# EAGLE design Qwiic_Grideye (EAGLE 7.7.0)
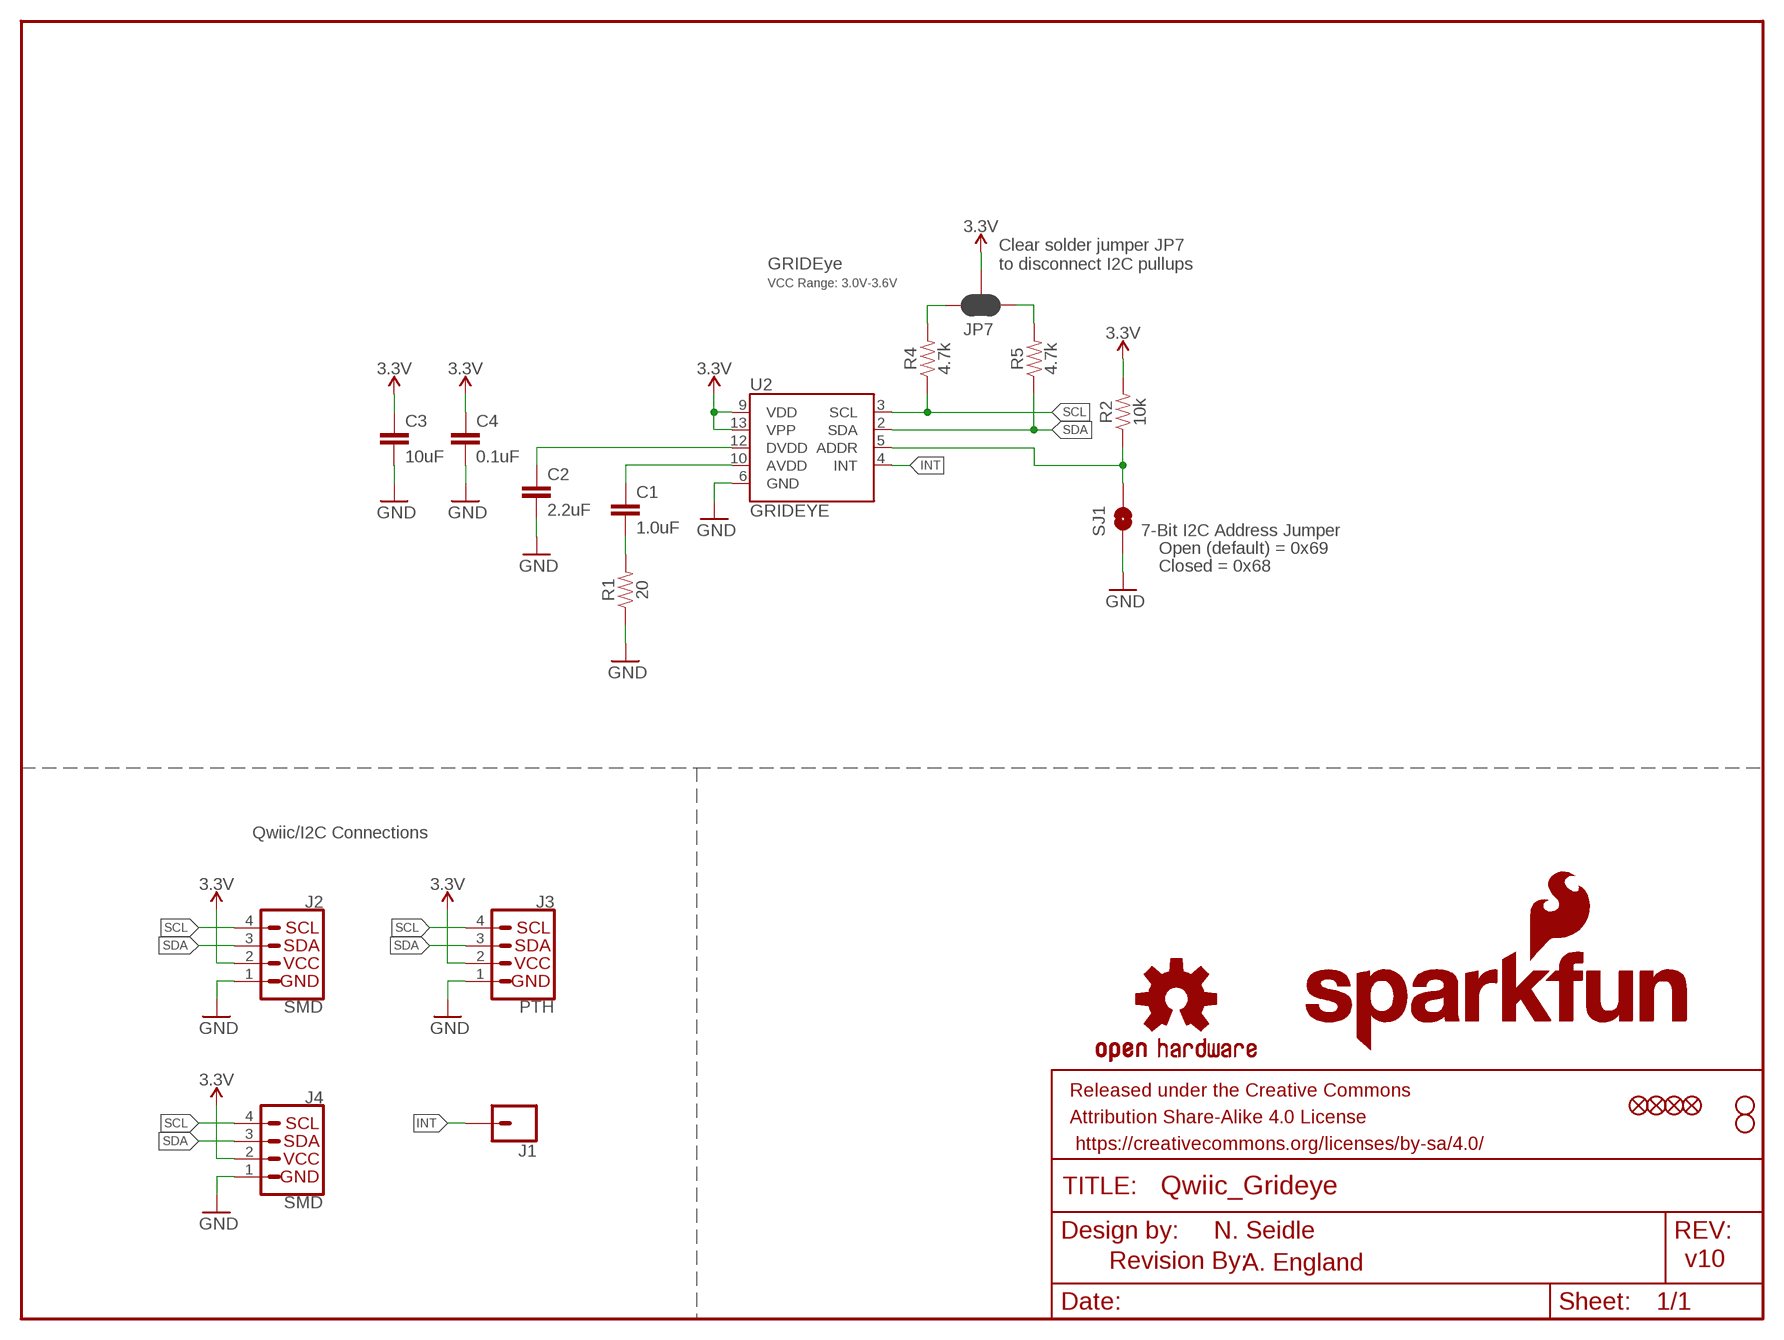
[diagram p0: schematic, sheet 1]

## Parts
C1  1.0uF  1.0UF-0603-16V-10%  [0603]
C2  2.2uF  2.2UF-0603-10V-20%  [0603]
C3  10uF  10UF-0603-6.3V-20%  [0603]
C4  0.1uF  0.1UF-0603-25V-(+80/-20%)  [0603]
FRAME1  FRAME-LETTER  [CREATIVE_COMMONS]
J1  CONN_01PTH_NO_SILK_YES_STOP  [1X01_NO_SILK]
J2  SMD  I2C_STANDARDJS-1MM  [1X04_1MM_RA]
J3  PTH  I2C_STANDARD_NO_SILK  [1X04_NO_SILK]
J4  SMD  I2C_STANDARDJS-1MM  [1X04_1MM_RA]
JP1  FIDUCIALUFIDUCIAL  [MICRO-FIDUCIAL]
JP2  FIDUCIALUFIDUCIAL  [MICRO-FIDUCIAL]
JP3  STAND-OFF  [STAND-OFF]
JP4  STAND-OFF  [STAND-OFF]
JP5  FIDUCIALUFIDUCIAL  [MICRO-FIDUCIAL]
JP6  FIDUCIALUFIDUCIAL  [MICRO-FIDUCIAL]
JP7  JUMPER-SMT_3_2-NC_PASTE_SILK  [SMT-JUMPER_3_2-NC_PASTE_SILK]
LOGO1  OSHW-LOGOMINI  [OSHW-LOGO-MINI]
LOGO2  REVISION  [REVISION]
R1  20  20OHM-0603-1/10W-1%  [0603]
R2  10k  10KOHM-0603-1/10W-1%  [0603]
R4  4.7k  4.7KOHM-0603-1/10W-1%  [0603]
R5  4.7k  4.7KOHM-0603-1/10W-1%  [0603]
SJ1  SOLDERJUMPERNO  [SJ_2S-NO]
U2  GRIDEYE  [GRIDEYE-AMG88]
U$1  SFE_LOGO_NAME.1_INCH  [SFE_LOGO_NAME_.1]
U$2  SFE_LOGO_NAME_FLAME.1_INCH  [SFE_LOGO_NAME_FLAME_.1]

## Nets
3.3V: C3.1 C4.1 J2.2(VCC) J3.2(VCC) J4.2(VCC) JP7.2 R2.2 U2.9(VDD) U2.13(VPP)
ADDR: R2.1 SJ1.2 U2.5(ADDR)
GND: C2.2 C3.2 C4.2 J2.1(GND) J3.1(GND) J4.1(GND) R1.1 SJ1.1 U2.6(GND)
INT: J1.1 U2.4(INT)
N$1: JP7.1 R5.2
N$2: JP7.3 R4.2
N$3: C2.1 U2.12(DVDD)
N$4: C1.1 U2.10(AVDD)
N$5: C1.2 R1.2
SCL: J2.4(SCL) J3.4(SCL) J4.4(SCL) R4.1 U2.3(SCL)
SDA: J2.3(SDA) J3.3(SDA) J4.3(SDA) R5.1 U2.2(SDA)

## Notes on the sheet
- GRIDEye
- Clear solder jumper JP7 
  to disconnect I2C pullups
- VCC Range: 3.0V-3.6V
- 7-Bit I2C Address Jumper
- Open (default) = 0x69
- Closed = 0x68
- Qwiic/I2C Connections
- N. Seidle
- A. England | v10

## Library data of the parts
C1 = SparkFun-Capacitors:1.0UF: 1µF ceramic capacitors A capacitor is a passive two-terminal electrical component used to store electrical energy temporarily in an electric field.; PROD_ID: CAP-00868
C2 = SparkFun-Capacitors:2.2UF: 2.2µF ceramic capacitors A capacitor is a passive two-terminal electrical component used to store electrical energy temporarily in an electric field.; PROD_ID: CAP-07888
C3 = SparkFun-Capacitors:10UF: 10.0µF ceramic capacitors A capacitor is a passive two-terminal electrical component used to store electrical energy temporarily in an electric field.; PROD_ID: CAP-11015
C4 = SparkFun-Capacitors:0.1UF: 0.1µF ceramic capacitors A capacitor is a passive two-terminal electrical component used to store electrical energy temporarily in an electric field.; PROD_ID: CAP-00810
FRAME1 = SparkFun-Aesthetics:FRAME-LETTER: Schematic Frame - Letter Standard 8.5x11 US Letter frame
J1 = SparkFun-Connectors:CONN_01: Single connection point. Often used as Generic Header-pin footprint for 0.1 inch spaced/style header connections On any of the 0.1 inch spaced packages, you can populate with these: Break Away Headers - Straight <https://www.sparkfun.com/products/116> (PRT-00116) Break Away Male Headers - Right Angle <https://www.sparkfun.com/products/553> (PRT-00553) Female Headers <https://www.sparkfun.com/products/115> (PRT-00115) Break Away Headers - Machine Pin <https://www.sparkfun.com/products/117> (PRT-00117) Break Away Female Headers - Swiss Machine Pin <https://www.sparkfun.com/products/743> (PRT-00743) This device is also useful as a general connection point to wire up your design to another part of your project. Our various solder wires solder well into these plated through hole pads. Hook-Up Wire - Assortment (Stranded, 22 AWG) <https://www.sparkfun.com/products/11375> (PRT-11375) Hook-Up Wire - Assortment (Solid Core, 22 AWG) <https://www.sparkfun.com/products/11367> (PRT-11367) View the entire wire category on our website here <https://www.sparkfun.com/categories/141> Special notes: SMTSO-256-ET is a "flush mount" nut for a 4-40 screw. We mostly use this on specialty testbeds; it is a nice way to connect hardware to your PCB at an adjustable hieght. Also note, the SNAP packages are for using a snappable style connector. We sell a baggie of snaps and they are also used on two LilyPad designs: Snap Assortment - 30 pack (male and female) <https://www.sparkfun.com/products/11347> (DEV-11347) LilyPad Arduino SimpleSnap <https://www.sparkfun.com/products/10941> (DEV-10941) LilyPad SimpleSnap Protoboard <https://www.sparkfun.com/products/10940> (DEV-10940)
J2-J4 = SparkX:I2C_STANDARD: SparkFun I2C Standard Pinout Header SparkFun has standardized on a pinout for all I2C based sensor breakouts. This pinout allows I2C boards to be plugged directly into the headers on Arduino Uno compatible boards, and to be daisy chained easily. Example SparkFun Products: SparkFun Atmospheric Sensor Breakout - BME280 <https://www.sparkfun.com/products/13676> SparkFun Altitude/Pressure Sensor Breakout - MPL3115A2 <https://www.sparkfun.com/products/11084> SparkFun TOF Range Finder Sensor - VL6180 <https://www.sparkfun.com/products/12785>
JP1 JP2 JP5 JP6 = SparkFun:FIDUCIAL: Fiducial Alignment Points Various fiducial points for machine vision alignment.
JP3 JP4 = SparkFun:STAND-OFF: Stand Off This is the mechanical footprint for a #4 phillips button head screw. Use the keepout ring to avoid running the screw head into surrounding components. SKU : PRT-00447
JP7 = SparkFun-Jumpers:JUMPER-SMT_3_2-NC_PASTE: Normally closed solder jumper (2 of 2 connections) This jumper has an aperture in the stencil to allow solder paste to bridge both connections. Both connections are normally closed (NC). Wick off the solder to open the connection(s). Reapply solder to reclose the connection(s).
LOGO1 = SparkFun-Aesthetics:OSHW-LOGO: Open-Source Hardware (OSHW) Logo This logo indicates the piece of hardware it is found on incorporates a OSHW license and/or adheres to the definition of open source hardware found here: http://freedomdefined.org/OSHW
LOGO2 = SparkFun-Aesthetics:REVISION: "Revision By" Text Preceding text for revisor documentation. Includes schematic text on "symbols" layer, and board text on tDoc.
R1 = SparkFun-Resistors:20OHM: RES-07862; PROD_ID: RES-07862
R2 = SparkFun-Resistors:10KOHM: 10kΩ resistor A resistor is a passive two-terminal electrical component that implements electrical resistance as a circuit element. Resistors act to reduce current flow, and, at the same time, act to lower voltage levels within circuits. - Wikipedia; PROD_ID: RES-00824
R4 R5 = SparkFun-Resistors:4.7KOHM: 4.7kΩ resistor A resistor is a passive two-terminal electrical component that implements electrical resistance as a circuit element. Resistors act to reduce current flow, and, at the same time, act to lower voltage levels within circuits. - Wikipedia; PROD_ID: RES-07857
SJ1 = SparkFun:SOLDERJUMPER: Solder Jumper Standard SMD solder jumper. Used to automate production. Two varients : Normally Open and Normally Closed are the same, but have different paste layers. NC will have a large amount of paste and should jumper during reflow.
U2 = SparkFun-Sensors:GRIDEYE: Panasonic AMG8833 GRIDEye This 8x8 thermopile infrared sensor array allows for a low resolution thermal camera.; PROD_ID: IC-13912
U$1 = SparkFun-Aesthetics:SFE_LOGO_NAME: SparkFun Font Logo This is the SparkFun name logo. The logo on the schematic will always be the same size; the package variant is the height of the flame part of the logo (or the height the flame would be, if it were drawn). Default layer for the logo on the board is tSilk.
U$2 = SparkFun-Aesthetics:SFE_LOGO_NAME_FLAME: SparkFun Font Logo w/ Flame This is the SparkFun full logo. The logo on the schematic will always be the same size; the package variant is the height of the flame part of the logo. Default layer for the logo on the board is tSilk.

## Board
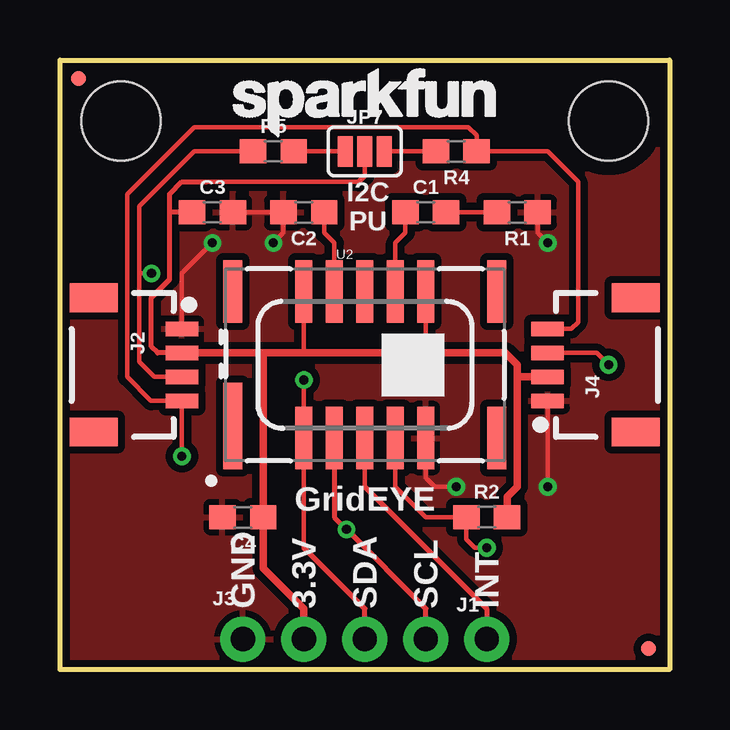
[diagram p1: board, top side]
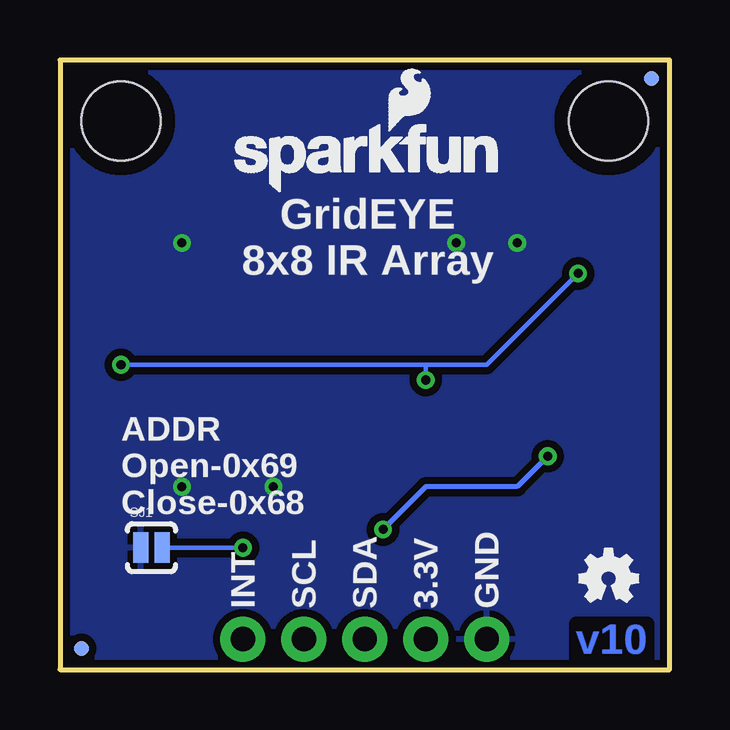
[diagram p2: board, bottom side, seen from below]

Size 25.4 x 25.4 mm. Coordinates in mm from the lower left corner, seen from the top.
Outline: 0,0 0,25.4 25.4,25.4 25.4,0 0,0
Copper layers (1*16): Top 0.035mm / dielectric 1.5mm / Bottom 0.035mm
Design rules "SparkFun-2-layer-TIGHT": minimum track width 7mil, minimum drill 15mil, track to track 7mil, track to pad 7mil, pad to pad 7mil, via to via 7mil, smd to smd 7mil, copper to edge 7mil, drill to drill 7mil, minimum pad ring 7mil, minimum via ring 7mil, stop-mask expansion 4mil, vias tented up to drill 25mil, thermal gap 10mil

### Footprints (pad centres in the part's own frame; a part is rotated, then mirrored left to right if it is on the bottom)
0603 = smd 1.1 x 1: 1 -0.85,0; 2 0.85,0
1X01_NO_SILK = drill 1.016 pad 1.88: 1 0,0
1X04_1MM_RA = smd 0.6 x 1.35: 1 -1.5,0; 2 -0.5,0; 3 0.5,0; 4 1.5,0 | smd 1.2 x 2: NC1 2.8,-3.675; NC2 -2.8,-3.675
1X04_NO_SILK = drill 1.016 pad 1.88: 1 0,0; 2 2.54,0; 3 5.08,0; 4 7.62,0
MICRO-FIDUCIAL = smd 0.635 x 0.635: 1 0,0
STAND-OFF = hole 3.302: 0,0
SMT-JUMPER_3_2-NC_PASTE_SILK = smd 0.635 x 1.27: 1 -0.813,0; 2 0,0; 3 0.813,0
SJ_2S-NO = smd 0.635 x 1.27: 1 -0.45,0; 2 0.45,0
GRIDEYE-AMG88 = smd 0.8 x 3.6: 1 -5.5,-2.55 | smd 0.7 x 2.6: 2 -2.54,-3.05; 3 -1.27,-3.05; 4 0,-3.05; 5 1.27,-3.05; 6 2.54,-3.05; 9 2.54,3.05; 10 1.27,3.05; 11 0,3.05; 12 -1.27,3.05; 13 -2.54,3.05 | smd 0.8 x 2.6: 7 5.5,-3.05; 8 5.5,3.05; 14 -5.5,3.05

### Placement (x,y rotation side)
C1  15.24,19.05 0 top
C2  10.16,19.05 180 top
C3  6.35,19.05 0 top
C4  7.62,6.35 180 top
FRAME1  -13.97,-7.62 0 top  (outside the outline)
J1  17.78,1.27 0 top
J2  5.08,12.7 270 top
J3  7.62,1.27 0 top
J4  20.32,12.7 90 top
JP1  24.51,0.89 0 bottom
JP2  24.51,0.89 0 top
JP3  2.54,22.86 0 top
JP4  22.86,22.86 0 top
JP5  0.76,24.64 0 bottom
JP6  0.76,24.64 0 top
JP7  12.7,21.59 0 top
LOGO1  2.54,3.81 0 bottom
LOGO2  -2.54,-10.16 0 top  (outside the outline)
R1  19.05,19.05 180 top
R2  17.78,6.35 0 top
R4  16.51,21.59 180 top
R5  8.89,21.59 0 top
SJ1  21.59,5.08 0 bottom
U2  12.7,12.7 0 top
U$1  6.73,21.72 0 top
U$2  18.54,19.81 0 bottom

### Tracks (layer width: path | path; a pad name or v marks a point on that pad's centre or on a via)
3.3V
  Top 0.178: J2.2 | JP7.2 12.7,20.57 | 10.16,13.2 U2.13 | 19.06,12.2 19.05,12.19 | U2.9 15.24,13.2 | 8.47,13.16 8.51,13.2 | 12.45,20.32 6.1,20.32
  Top 0.203: 12.7,20.57 12.45,20.32 | J2.2 4.07,13.2 3.81,13.46 3.81,15.49 4.57,16.26 4.57,19.05 | C3.1 4.57,19.05 | 4.57,19.05 4.57,19.81 5.08,20.32 6.1,20.32
  Top 0.305: J4.2 19.06,12.2 | R2.2 18.63,7.2 19.05,7.62 19.05,12.19 19.05,12.7 18.55,13.2 15.24,13.2 10.16,13.2 8.51,13.2 J2.2 | 8.47,13.16 C4.1 8.47,4.23 10.16,2.54 J3.2
ADDR  (via drill 0.38)
  Top 0.178: U2.5 13.97,7.62 15.24,6.35 R2.1 16.93,5.42 17.27,5.08 v17.78,5.08
  Bottom 0.178: SJ1.2 v17.78,5.08
GND  (via drill 0.38)
  Top 0.178: R1.1 19.9,18.2 v20.32,17.78 | v8.89,17.78 9.31,18.2 C2.2 C3.2 | J2.1 5.08,16.51 v6.35,17.78 | J4.1 v20.32,7.62 | U2.6 15.24,8 15.62,7.62 v16.51,7.62
  pour Bottom (isolate 0.305): 0,0 0,25.4 25.4,25.4 25.4,0
  pour Top (isolate 0.305): 0,0 0,25.4 25.4,25.4 25.4,0
INT
  Top 0.178: U2.4 12.7,7.62
  Top 0.203: 12.7,7.62 17.78,2.54 J1.1
N$1
  Top 0.178: R5.2 JP7.1
N$2
  Top 0.178: JP7.3 R4.2
N$3
  Top 0.178: U2.12 11.43,17.78 11.01,18.2 C2.1
N$4
  Top 0.178: U2.10 13.97,17.78 14.39,18.2 C1.1
N$5
  Top 0.178: R1.2 C1.2
SCL  (via drill 0.38)
  Top 0.178: J4.4 21.31,14.2 21.59,14.48 21.59,20.32 20.32,21.59 R4.1 17.36,22.26 17.02,22.61 5.59,22.61 2.79,19.81 2.79,12.19 3.79,11.2 J2.4 v5.08,8.89
  Top 0.203: J3.4 15.24,2.54 v11.94,5.84 11.43,6.35 U2.3
  Bottom 0.203: v11.94,5.84 10.16,7.62 6.35,7.62 v5.08,8.89
SDA  (via drill 0.38)
  Top 0.178: J2.3 3.94,12.2 3.94,12.19 3.3,12.83 3.3,16.51 | 10.16,5.08 U2.2 v10.16,12.06 10.16,12.2 | R5.1 5.59,21.59 3.3,19.3 3.3,16.51 | J4.3 22.36,13.2 v22.86,12.7 | v3.81,16.51 3.3,16.51
  Top 0.203: J3.3 12.7,2.54 10.16,5.08
  Bottom 0.178: v22.86,12.7 10.16,12.7 | 10.16,12.7 7.62,12.7 v3.81,16.51 | v10.16,12.06 10.16,12.7

### Text on the board
Bottom: v10
tPlace: I2C / PU | GridEYE | GND | 3.3V | SDA | SCL | INT
bPlace: GridEYE / 8x8 IR Array | ADDR / Open-0x69 / Close-0x68 | GND | 3.3V | SDA | SCL | INT
Measures: Units in Inches
tDocu: N. Seidle | A. England